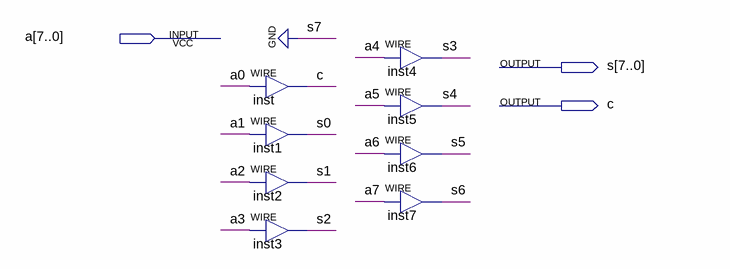
[diagram p0: schematic sheet]
// Quartus schematic shr.bdf as structural Verilog: 8 symbols, 3 pins
module shr (
  input  [7:0] a,
  output [7:0] s,
  output c
);

  assign c = a[0];  // WIRE inst
  assign s[0] = a[1];  // WIRE inst1
  assign s[1] = a[2];  // WIRE inst2
  assign s[2] = a[3];  // WIRE inst3
  assign s[3] = a[4];  // WIRE inst4
  assign s[4] = a[5];  // WIRE inst5
  assign s[5] = a[6];  // WIRE inst6
  assign s[6] = a[7];  // WIRE inst7

  assign s[7] = 1'b0;
endmodule
